# Altium schematic sheet PackVoltageCurrentSensor.SchDoc
size A; SheetNumber: 3; SheetTotal: 4
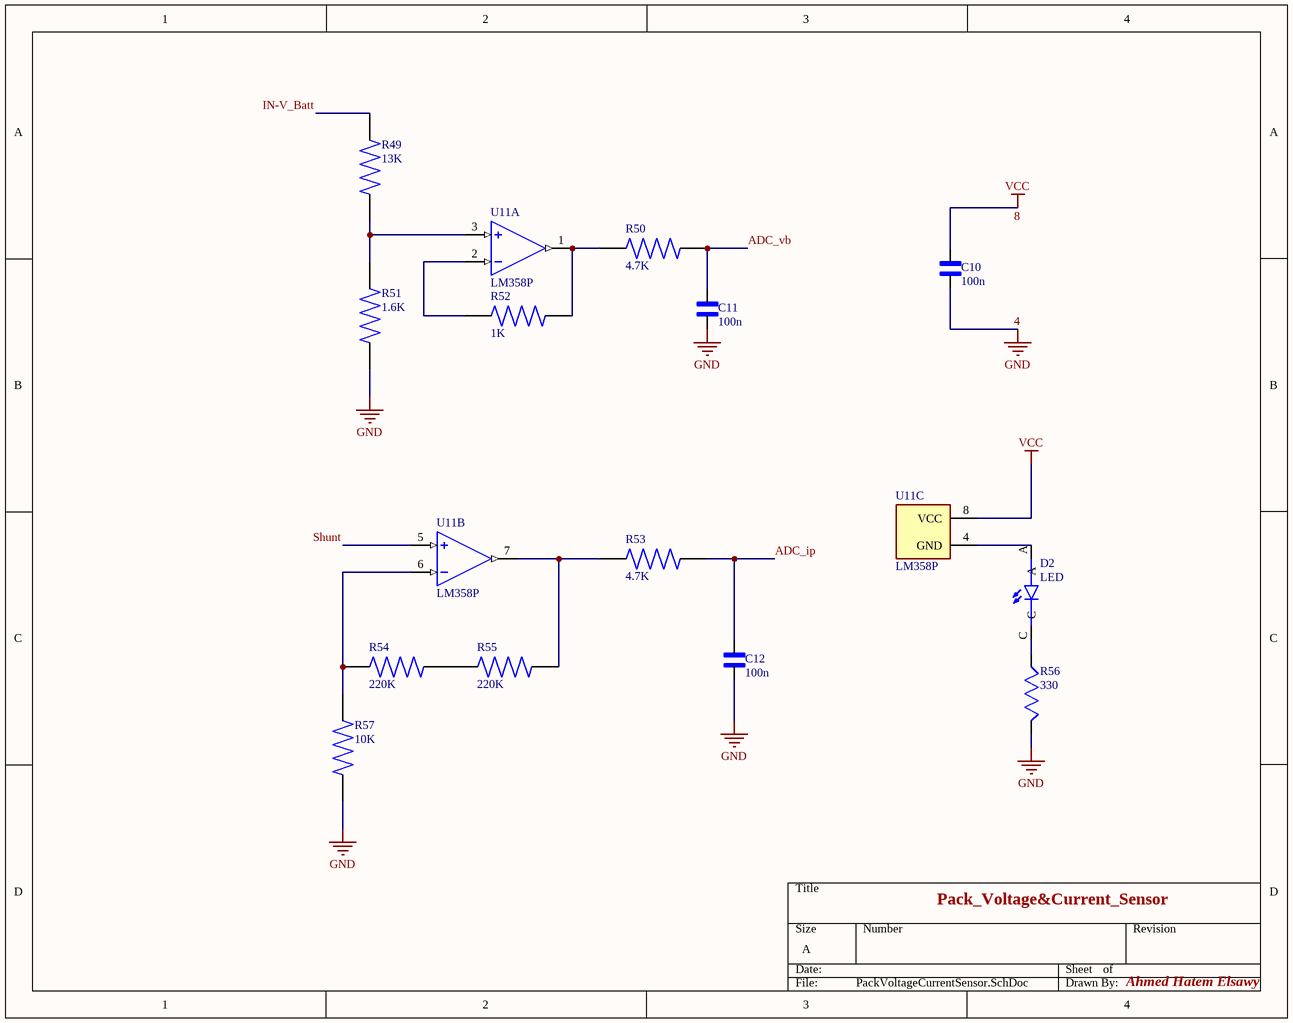
[diagram p0: PackVoltageCurrentSensor.SchDoc]

## Parts
C10  100n  [CAPC1608X90N]
C11  100n  [CAPC1608X90N]
C12  100n  [CAPC1608X90N]
D2  LED  [LED_WP7113ID]
R49  13K  [RES_ERJU03J133V]
R50  4.7K  [RES_ERJS06J472V]
R51  1.6K  [RES_ERA6ARB162V]
R52  1K  [RESC1608X55N]
R53  4.7K  [RES_ERJS06J472V]
R54  220K  [RES_ERJS06J224V]
R55  220K  [RES_ERJS06J224V]
R56  330  [RESC3216X65]
R57  10K  [RES_ERA8ARW103V]
U11  LM358P  [DIP794W45P254L959H508Q8]  (parts A,B,C of 3)

## Nets
4: C10.2 C11.2 C12.2 R51.1 R56.1 R57.1  [also labelled GND]
8: C10.1 U11.8(VCC)  [also labelled VCC]
ADC_ip: C12.1 R53.2
ADC_vb: C11.1 R50.2
IN-V_Batt: R49.2
Shunt: U11.5(+IN2)
NetD2_A: D2.A U11.4(GND)
NetD2_C: D2.C R56.2
NetR49_1: R49.1 R51.2 U11.3(+IN1)
NetR50_1: R50.1 R52.2 U11.1(OUT1)
NetR52_1: R52.1 U11.2(-IN1)
NetR53_1: R53.1 R55.2 U11.7(OUT2)
NetR54_1: R54.1 R57.2 U11.6(-IN2)
NetR54_2: R54.2 R55.1

## Notes on the sheet
- Pack_Voltage&Current_Sensor
- Ahmed Hatem Elsawy

## Library data of the parts
C10-C12 = 06035C104K4T2A: Capacitor MLCC 0603 100nF 50V | AVX 06035C104K4T2A; SnapEDA_Link: https://www.snapeda.com/parts/06035C104K4T2A/AVX/view-part/?ref=snap; Package: 1608 AVX; Value: *; MF: AVX; MP: 06035C104K4T2A; Check_prices: https://www.snapeda.com/parts/06035C104K4T2A/AVX/view-part/?ref=eda
D2 = WP7113ID: Red 617nm LED Indication - Discrete 2V Radial; MF: Kingbright; Price: None; MP: WP7113ID; Package: Radial Kingbright; Check_prices: https://www.snapeda.com/parts/WP7113ID/Kingbright/view-part/?ref=eda; Purchase-URL: https://pricing.snapeda.com/search/part/WP7113ID/?ref=eda; Availability: In Stock; Value: *; SnapEDA_Link: https://www.snapeda.com/parts/WP7113ID/Kingbright/view-part/?ref=snap
R49 = ERJU03J133V: RES 13K OHM 5% 1/10W 0603 SMD; MF: Panasonic; MP: ERJ-U03J133V; SnapEDA_Link: https://www.snapeda.com/parts/ERJ-U03J133V/Panasonic/view-part/?ref=snap; Package: 1608-2 Panasonic; Value: *; Check_prices: https://www.snapeda.com/parts/ERJ-U03J133V/Panasonic/view-part/?ref=eda
R50 R53 = ERJS06J472V: Price: None; Availability: Unavailable; MP: ERJS06J472V; Package: None; Value: *
R51 = ERA6ARB162V: MP: ERA6ARB162V; Availability: Unavailable; Value: *; Package: None; Price: None
R52 = CR0603AFX-1001EAS: DirenÃ§, AS 0603 1k %1 100mW TC100 ¦ Bourns CR0603AFX-1001EAS; SnapEDA_Link: https://www.snapeda.com/parts/CR0603AFX-1001EAS/Bourns/view-part/?ref=snap; Package: 0603-2 Bourns; Value: *; MF: Bourns; MP: CR0603AFX-1001EAS; Check_prices: https://www.snapeda.com/parts/CR0603AFX-1001EAS/Bourns/view-part/?ref=eda
R54 R55 = ERJS06J224V: Availability: Unavailable; Price: None; Value: *; MP: ERJS06J224V; Package: None
R56 = RC1206JR-13330RL: Res Thick Film 1206 330 Ohm 5% 0.25W(1/4W) Â±100ppm/Â°C Epoxy Pad SMD T/R; MF: Yageo Corporation; MP: RC1206JR13330RL; SnapEDA_Link: https://www.snapeda.com/parts/RC1206JR13330RL/Yageo/view-part/?ref=snap; Package: 1206-2 YAGEO; Value: *; Check_prices: https://www.snapeda.com/parts/RC1206JR13330RL/Yageo/view-part/?ref=eda
R57 = ERA8ARW103V: MP: ERA8ARW103V; Availability: Unavailable; Package: None; Price: None; Value: *
U11 = LM358P: Dual, 30-V, 700-kHz operational amplifier; MF: Texas Instruments; SnapEDA_Link: https://www.snapeda.com/parts/LM358P/Texas+Instruments/view-part/?ref=snap; Package: PDIP-8 Texas; Value: *; MP: LM358P; Check_prices: https://www.snapeda.com/parts/LM358P/Texas+Instruments/view-part/?ref=eda